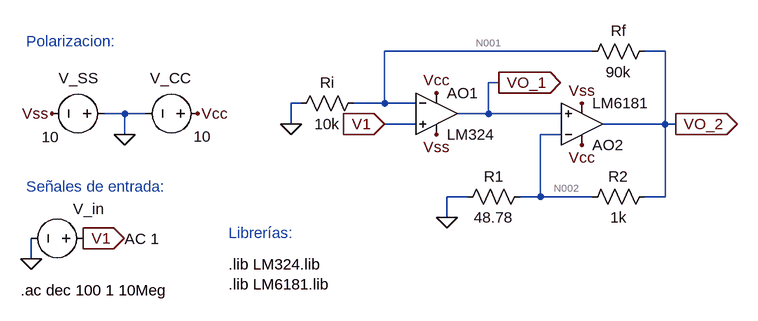
[diagram p0: schematic Lab_3_Circ_2-Respuesta en frecuencia.asc]
Lab_3_Circ_2-Respuesta en frecuencia.asc, the LTspice schematic file:
Version 4
SHEET 1 1704 680
WIRE 752 -352 432 -352
WIRE 864 -352 832 -352
WIRE 608 -304 592 -304
WIRE 304 -272 288 -272
WIRE 432 -272 432 -352
WIRE 432 -272 384 -272
WIRE 480 -272 432 -272
WIRE 32 -256 0 -256
WIRE 64 -256 32 -256
WIRE 592 -256 592 -304
WIRE 592 -256 544 -256
WIRE 704 -256 592 -256
WIRE 288 -240 288 -272
WIRE 480 -240 432 -240
WIRE 864 -240 864 -352
WIRE 864 -240 768 -240
WIRE 880 -240 864 -240
WIRE 32 -224 32 -256
WIRE 704 -224 672 -224
WIRE 560 -128 528 -128
WIRE 672 -128 672 -224
WIRE 672 -128 640 -128
WIRE 752 -128 672 -128
WIRE 864 -128 864 -240
WIRE 864 -128 832 -128
WIRE 528 -96 528 -128
WIRE -112 -32 -112 -64
FLAG 528 -96 0
FLAG 144 -256 Vcc
FLAG 512 -288 Vcc
FLAG -80 -256 Vss
FLAG 512 -224 Vss
FLAG 32 -224 0
FLAG -112 -32 0
FLAG 432 -240 V1
IOPIN 432 -240 In
FLAG -32 -64 V1
IOPIN -32 -64 Out
FLAG 880 -240 VO_2
IOPIN 880 -240 Out
FLAG 736 -208 Vcc
FLAG 736 -272 Vss
FLAG 288 -240 0
FLAG 608 -304 VO_1
IOPIN 608 -304 Out
SYMBOL OpAmps\\opamp2 512 -320 R0
SYMATTR InstName AO1
SYMATTR Value LM324
SYMBOL res 656 -144 R90
WINDOW 0 0 56 VBottom 2
WINDOW 3 32 56 VTop 2
SYMATTR InstName R1
SYMATTR Value 48.78
SYMBOL res 736 -112 R270
WINDOW 0 32 56 VTop 2
WINDOW 3 0 56 VBottom 2
SYMATTR InstName R2
SYMATTR Value 1k
SYMBOL res 848 -368 R90
WINDOW 0 0 56 VBottom 2
WINDOW 3 32 56 VTop 2
SYMATTR InstName Rf
SYMATTR Value 90k
SYMBOL res 288 -256 R270
WINDOW 0 32 56 VTop 2
WINDOW 3 0 56 VBottom 2
SYMATTR InstName Ri
SYMATTR Value 10k
SYMBOL voltage -16 -64 M270
WINDOW 0 45 31 VLeft 2
WINDOW 3 1 -53 VLeft 2
WINDOW 123 -1 -48 VLeft 2
WINDOW 39 0 0 Left 0
SYMATTR InstName V_in
SYMATTR Value ""
SYMATTR Value2 AC 1
SYMBOL voltage 160 -256 R90
WINDOW 0 -55 25 VRight 2
WINDOW 3 35 -5 VRight 2
WINDOW 123 0 0 Left 0
WINDOW 39 0 0 Left 0
SYMATTR InstName V_CC
SYMATTR Value 10
SYMBOL voltage 16 -256 R90
WINDOW 0 -55 25 VRight 2
WINDOW 3 36 85 VRight 2
WINDOW 123 0 0 Left 0
WINDOW 39 0 0 Left 0
SYMATTR InstName V_SS
SYMATTR Value 10
SYMBOL OpAmps\\opamp2 736 -176 M180
SYMATTR InstName AO2
SYMATTR Value LM6181
TEXT 192 -24 Left 2 !.lib LM324.lib\n.lib LM6181.lib
TEXT 192 -72 Left 2 ;Librerías:
TEXT -120 -368 Left 2 ;Polarizacion:
TEXT -120 -144 Left 2 ;Señales de entrada:
TEXT -128 16 Left 2 !.ac dec 100 1 10Meg

The netlist it stands for:
* Lab_3_Circ_2-Respuesta en frecuencia.asc
XAO1 V1 N001 Vcc Vss VO_1 LM324  ; pins In+ In- V+ V- OUT
R1 N002 0 48.78
R2 N002 VO_2 1k
Rf VO_2 N001 90k
Ri 0 N001 10k
V_in V1 0 AC 1
V_CC Vcc 0 10
V_SS 0 Vss 10
XAO2 VO_1 N002 Vcc Vss VO_2 LM6181  ; pins In+ In- V+ V- OUT
.lib LM324.lib
.lib LM6181.lib
* Librerías:
* Polarizacion:
* Señales de entrada:
.ac dec 100 1 10Meg
.backanno
.end

* Results of the author's LTspice run, read from the files saved beside the schematic
* Operating Point, zero values left out:
*   V(vo_1) = -2.243 mV
*   V(vss) = -10 V
*   V(vcc) = 10 V
*   V(n001) = -33.63 µV
*   V(n002) = 156.7 µV
*   V(vo_2) = -2.131 mV
*   I(Ri) = 3.363 nA
*   I(Rf) = -23.3 nA
*   I(R2) = 2.288 µA
*   I(R1) = 3.212 µA
*   I(V_ss) = -7.424 mA
*   I(V_cc) = -7.426 mA
*   I(V_in) = 19.92 nA
*   Ix(u1:1) = -19.92 nA
*   Ix(u1:2) = -19.94 nA
*   Ix(u1:3) = 669.9 µA
*   Ix(u1:4) = -669.8 µA
*   Ix(u1:5) = -1.1 µA
*   Ix(u2:1) = 1.1 µA
*   Ix(u2:2) = -5.499 µA
*   Ix(u2:99) = 6.756 mA
*   Ix(u2:50) = -6.754 mA
*   Ix(u2:41) = 2.311 µA
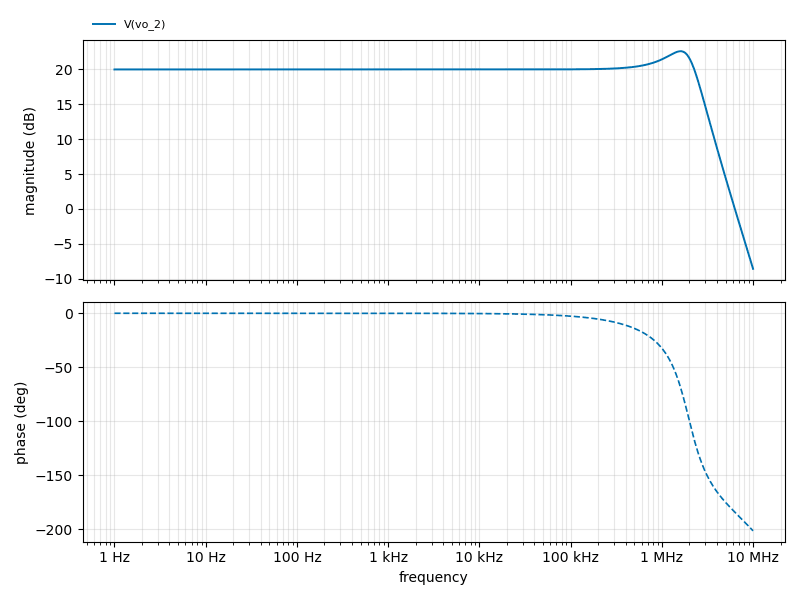
[diagram p1: AC Analysis of Lab_3_Circ_2-Respuesta en frecuencia.asc, plotted from the saved traces]
* AC Analysis, 1 run:
*   V(vo_2): 20.00 dB at 1 Hz, -8.57 dB at 10 MHz, peak 22.61 dB at 1.622 MHz, 3 dB below the peak at 2.323 MHz